# Altium schematic sheet SplitterWaveyRadar.SchDoc: Splitter WaveyRadar Schematic
size Letter; Author: Will Vu; CompanyName: Raccoon Wireless; DrawnBy: Will Vu, Raccoon Wireless; Engineer: Will Vu; Organization: Raccoon Wireless; DocumentNumber: 2-06; Revision: 2; SheetNumber: 6; SheetTotal: 15
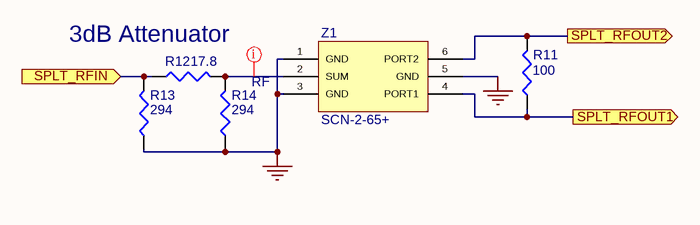
[diagram p0: SplitterWaveyRadar.SchDoc]

## Parts
R11  value 100  [RESC0402(1005)_L]  (hidden comment: Resistor 100R +/-1 % 0402 63 mW)
R12  value 17.8  [FP-CR0402-IPC_C]  (hidden comment: CR0402-FX-17R8GLF)
R13  value 294  [RESC1005X40X25NL05T10]  (hidden comment: RC0402FR-07294RL)
R14  value 294  [RESC1005X40X25NL05T10]  (hidden comment: RC0402FR-07294RL)
Z1  SCN-2-65+  [SCN-2-65+-Footprint-1]

## Ports
SPLT_RFIN (in), SPLT_RFOUT1 (out), SPLT_RFOUT2 (out)

## Nets
GND: R13.1 R14.1 Z1.1(GND) Z1.3(GND) Z1.5(GND)
SPLT_RFIN: R12.1 R13.2 ; port SPLT_RFIN
SPLT_RFOUT1: R11.1 Z1.4(PORT1) ; port SPLT_RFOUT1
SPLT_RFOUT2: R11.2 Z1.6(PORT2) ; port SPLT_RFOUT2
NetR12_2: R12.2 R14.2 Z1.2(SUM)

## Layout directives
net class RF: NetR12_2

## Notes on the sheet
- 3dB Attenuator
- /

## Library data of the parts
R11 = CMP-009-00167-4: Chip Resistor, 100 Ohms, +/-1 %, 63 mW, -55 to 155 degC, 0402; Power: 63mW; Tolerance: 1%; Pins: 2; Min Operating Temperature: -55°C; Case/Package: 0402; Max Operating Temperature: 155°C
R12 = CMP-009-00191-1: Thick Film Resistors - SMD 17.8OHM 1/16WATT 1%
R13 R14 = CMP-009-00190-1: Res Thick Film 0402 294 Ohm 1% 1/16W 100ppm/C Molded SMD Paper T/R
Z1 = CMP-00025-00003-5: 2-Way 50 ohm Power Splitter/Combiner. 5500 to 6500MHz; Frequency: 6GHz; Case/Package: FV1206-1